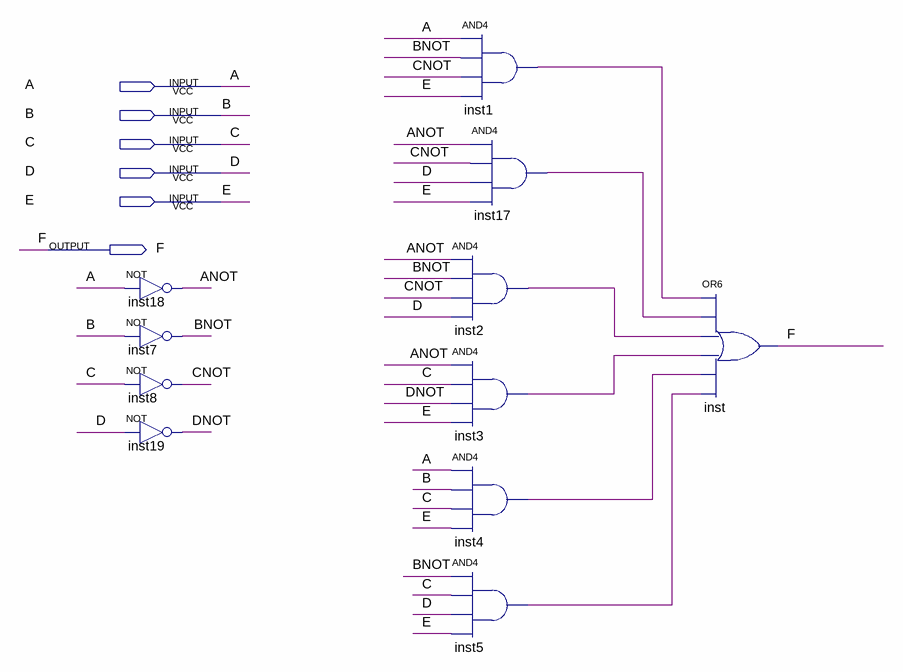
[diagram p0: schematic sheet]
// Quartus schematic Prime_5bit.bdf as structural Verilog: 11 symbols, 6 pins
module Prime_5bit (
  input  A,
  input  B,
  input  C,
  input  D,
  input  E,
  output F
);

  wire ANOT, BNOT, CNOT, DNOT, inst1_out, inst2_out, inst3_out, inst4_out, inst5_out, inst17_out;

  not inst18 (ANOT, A);
  not inst7 (BNOT, B);
  not inst8 (CNOT, C);
  not inst19 (DNOT, D);
  and inst1 (inst1_out, A, BNOT, CNOT, E);
  and inst17 (inst17_out, ANOT, CNOT, D, E);
  and inst2 (inst2_out, ANOT, BNOT, CNOT, D);
  and inst3 (inst3_out, ANOT, C, DNOT, E);
  and inst4 (inst4_out, A, B, C, E);
  and inst5 (inst5_out, BNOT, C, D, E);
  or inst (F, inst1_out, inst17_out, inst2_out, inst3_out, inst4_out, inst5_out);
endmodule
